# Altium schematic sheet MemoryControl.SchDoc
size A4
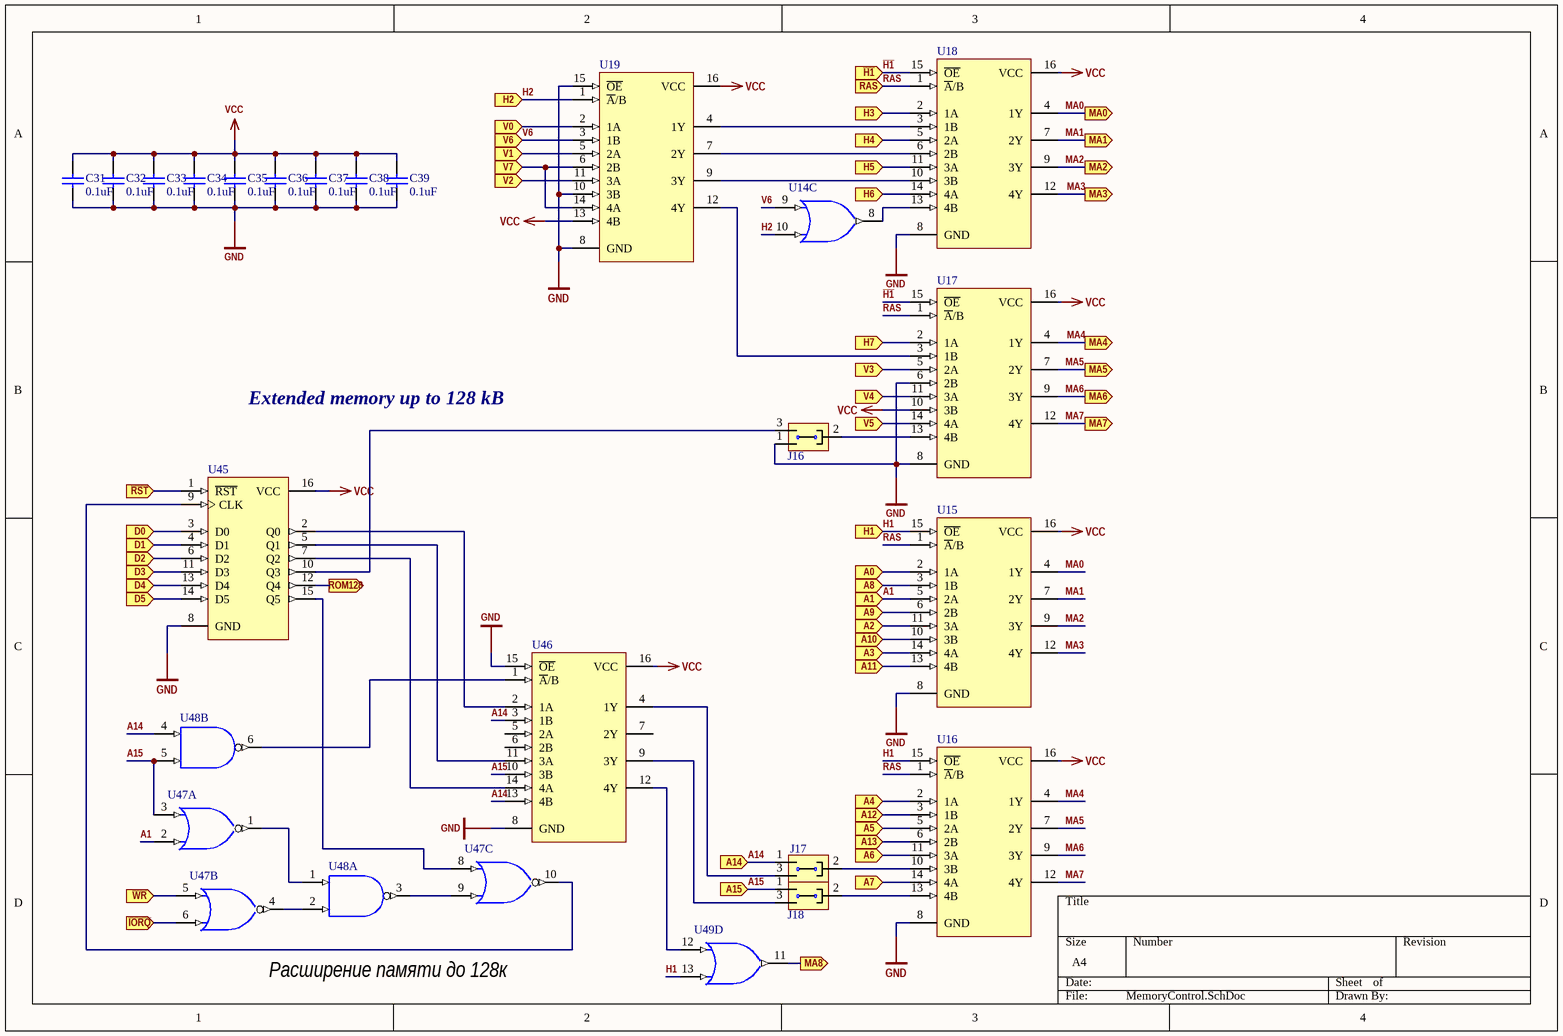
[diagram p0: MemoryControl.SchDoc]

## Parts
C31  value 0.1uF  [RAD-0.3]  (hidden comment: Cap)
C32  value 0.1uF  [RAD-0.3]  (hidden comment: Cap)
C33  value 0.1uF  [RAD-0.3]  (hidden comment: Cap)
C34  value 0.1uF  [RAD-0.3]  (hidden comment: Cap)
C35  value 0.1uF  [RAD-0.3]  (hidden comment: Cap)
C36  value 0.1uF  [RAD-0.3]  (hidden comment: Cap)
C37  value 0.1uF  [RAD-0.3]  (hidden comment: Cap)
C38  value 0.1uF  [RAD-0.3]  (hidden comment: Cap)
C39  value 0.1uF  [RAD-0.3]  (hidden comment: Cap)
J16  Jump3  [MHDR1X3]  (value not drawn)
J17  Jump3  [MHDR1X3]  (value not drawn)
J18  Jump3  [MHDR1X3]  (value not drawn)
U14  (no value)  [N014]  (part C of 4)
U15  (no value)  [N016]
U16  (no value)  [N016]
U17  (no value)  [N016]
U18  (no value)  [N016]
U19  (no value)  [N016]
U45  SN74HC174N  [N016]  (value not drawn)
U46  SN74HC257N  [N016]  (value not drawn)
U47  SN74HC02N  [N014]  (value not drawn)  (parts A,B,C of 4)
U48  SN74HC00N  [N014]  (value not drawn)  (parts A,B of 4)
U49  SN74HC32N  [N014]  (value not drawn)  (part D of 4)

## Ports
A0 (in), A1 (in), A2 (in), A3 (in), A4 (in), A5 (in), A6 (in), A7 (in), A8 (in), A9 (in), A10 (in), A11 (in), A12 (in), A13 (in), A14 (in), A15 (in), D0 (in), D1 (in), D2 (in), D3 (in), D4 (in), D5 (in), H1 (in), H2 (in), H3 (in), H4 (in), H5 (in), H6 (in), H7 (in), MA0 (out), MA1 (out), MA2 (out), MA3 (out), MA4 (out), MA5 (out), MA6 (out), MA7 (out), MA8 (out), RAS (in), ROM128 (out), V0 (in), V1 (in), V2 (in), V3 (in), V4 (in), V5 (in), V6 (in), V7 (in), ~{H1} (in), ~{IORQ} (in), ~{RST} (in), ~{WR} (in)

## Nets
GND: C31.1 C32.1 C33.1 C34.1 C35.1 C36.1 C37.1 C38.1 C39.1 J16.1 U14.7(GND) U15.8(GND) U16.8(GND) U17.6(2B) U17.8(GND) U18.8(GND) U19.8(GND) U19.10(3B) U19.15(~{OE}) U45.8(GND) U46.8(GND) U46.15(~{OE}) U47.7(GND) U48.7(GND) U49.7(GND)
VCC: C31.2 C32.2 C33.2 C34.2 C35.2 C36.2 C37.2 C38.2 C39.2 U14.14(VCC) U15.16(VCC) U16.16(VCC) U17.10(3B) U17.16(VCC) U18.16(VCC) U19.13(4B) U19.16(VCC) U45.16(VCC) U46.16(VCC) U47.14(VCC) U48.14(VCC) U49.14(VCC)
A0: U15.2(1A) ; port A0
A1: U15.5(2A) U47.2(A) ; port A1
A2: U15.11(3A) ; port A2
A3: U15.14(4A) ; port A3
A4: U16.2(1A) ; port A4
A5: U16.5(2A) ; port A5
A6: U16.11(3A) ; port A6
A7: U16.14(4A) ; port A7
A8: U15.3(1B) ; port A8
A9: U15.6(2B) ; port A9
A10: U15.10(3B) ; port A10
A11: U15.13(4B) ; port A11
A12: U16.3(1B) ; port A12
A13: U16.6(2B) ; port A13
A14: J17.1 U46.3(1B) U46.13(4B) U48.4(A) ; port A14
A15: J18.1 U46.10(3B) U47.3(B) U48.5(B) ; port A15
D0: U45.3(D0) ; port D0
D1: U45.4(D1) ; port D1
D2: U45.6(D2) ; port D2
D3: U45.11(D3) ; port D3
D4: U45.13(D4) ; port D4
D5: U45.14(D5) ; port D5
H1: U15.15(~{OE}) U16.15(~{OE}) U49.13(B) ; port H1
H2: U14.10(B) U19.1(~{A}/B) ; port H2
H3: U18.2(1A) ; port H3
H4: U18.5(2A) ; port H4
H5: U18.11(3A) ; port H5
H6: U18.14(4A) ; port H6
H7: U17.2(1A) ; port H7
~{H1}: U17.15(~{OE}) U18.15(~{OE}) ; port ~{H1}
~{IORQ}: U47.6(B) ; port ~{IORQ}
MA0: U15.4(1Y) U18.4(1Y) ; port MA0
MA1: U15.7(2Y) U18.7(2Y) ; port MA1
MA2: U15.9(3Y) U18.9(3Y) ; port MA2
MA3: U15.12(4Y) U18.12(4Y) ; port MA3
MA4: U16.4(1Y) U17.4(1Y) ; port MA4
MA5: U16.7(2Y) U17.7(2Y) ; port MA5
MA6: U16.9(3Y) U17.9(3Y) ; port MA6
MA7: U16.12(4Y) U17.12(4Y) ; port MA7
MA8: U49.11(Y) ; port MA8
~{RST}: U45.1(~{RST}) ; port ~{RST}
RAS: U15.1(~{A}/B) U16.1(~{A}/B) U17.1(~{A}/B) U18.1(~{A}/B) ; port RAS
ROM128: U45.12(Q4) ; port ROM128
V0: U19.2(1A) ; port V0
V1: U19.5(2A) ; port V1
V2: U19.11(3A) ; port V2
V3: U17.5(2A) ; port V3
V4: U17.11(3A) ; port V4
V5: U17.14(4A) ; port V5
V6: U14.9(A) U19.3(1B) ; port V6
V7: U19.6(2B) U19.14(4A) ; port V7
~{WR}: U47.5(A) ; port ~{WR}
NetJ16_2: J16.2 U17.13(4B)
NetJ16_3: J16.3 U45.10(Q3)
NetJ17_2: J17.2 U16.10(3B)
NetJ17_3: J17.3 U46.4(1Y)
NetJ18_2: J18.2 U16.13(4B)
NetJ18_3: J18.3 U46.9(3Y)
NetU14_8: U14.8(Y) U18.13(4B)
NetU17_3: U17.3(1B) U19.12(4Y)
NetU18_3: U18.3(1B) U19.4(1Y)
NetU18_6: U18.6(2B) U19.7(2Y)
NetU18_10: U18.10(3B) U19.9(3Y)
NetU45_2: U45.2(Q0) U46.2(1A)
NetU45_5: U45.5(Q1) U46.11(3A)
NetU45_7: U45.7(Q2) U46.14(4A)
NetU45_9: U45.9(CLK) U47.10(Y)
NetU45_15: U45.15(Q5) U47.8(A)
NetU46_1: U46.1(~{A}/B) U48.6(Y)
NetU46_12: U46.12(4Y) U49.12(A)
NetU47_1: U47.1(Y) U48.1(A)
NetU47_4: U47.4(Y) U48.2(B)
NetU47_9: U47.9(B) U48.3(Y)

Not connected (* = marked no-connect by the designer): U46 5(2A) 6(2B) 7(2Y)

## Notes on the sheet
- Extended memory up to 128 kB
- Расширение памяти до 128к

## Library data of the parts
C31-C39 = Cap: Capacitor; Published: 8-Jun-2000; LatestRevisionDate: 17-Jul-2002; LatestRevisionNote: Re-released for DXP Platform.; PackageReference: RAD-0.3; Publisher: Altium Limited; PackageDescription: Radial Cap, Thru-Hole; 2 Leads; 0.3 in Pin Spacing
U14 U49 = SN74HC32N: Quadruple 2-Input Positive-OR Gate; Published: 8-Jun-2000; LatestRevisionDate: 04-Mar-2005; LatestRevisionNote: Stylized 3D Model Added.; DatasheetVersion: May-1997; PackageVersion: Oct-1995; PackageReference: N014; Publisher: Altium Limited; PackageDescription: DIP; 14 Leads; Row Spacing 7.62 mm; Pitch 2.54 mm; ComponentLink1Description: Manufacturer Link; ComponentLink1URL: http://www.ti.com/; ComponentLink2Description: Datasheet; ComponentLink2URL: http://www-s.ti.com/sc/ds/sn74hc32.pdf
U15-U19 U46 = SN74HC257N: Quadruple 2-Line to 1-Line Data Selector/Multiplexer with 3-State Outputs; Published: 8-Jun-2000; LatestRevisionDate: 04-Mar-2005; LatestRevisionNote: Stylized 3D Model Added.; DatasheetVersion: Jun-1989; PackageVersion: Oct-1995; PackageReference: N016; Publisher: Altium Limited; PackageDescription: DIP; 16 Leads; Row Spacing 7.62 mm; Pitch 2.54 mm; Code_JEDEC: MS-001-BB; ComponentLink1Description: Manufacturer Link; ComponentLink1URL: http://www.ti.com/; ComponentLink2Description: Datasheet; ComponentLink2URL: http://www-s.ti.com/sc/ds/sn74hc257.pdf
U45 = SN74HC174N: Hex D-Type Flip-Flop with Clear; Published: 8-Jun-2000; LatestRevisionDate: 04-Mar-2005; LatestRevisionNote: Stylized 3D Model Added.; DatasheetVersion: May-1997; PackageVersion: Oct-1995; PackageReference: N016; Publisher: Altium Limited; PackageDescription: DIP; 16 Leads; Row Spacing 7.62 mm; Pitch 2.54 mm; Code_JEDEC: MS-001-BB; ComponentLink1Description: Manufacturer Link; ComponentLink1URL: http://www.ti.com/; ComponentLink2Description: Datasheet; ComponentLink2URL: http://www-s.ti.com/sc/ds/sn74hc174.pdf
U47 = SN74HC02N: Quadruple 2-Input Positive-NOR Gate; Published: 8-Jun-2000; LatestRevisionDate: 04-Mar-2005; LatestRevisionNote: Stylized 3D Model Added.; DatasheetVersion: May-1997; PackageVersion: Oct-1995; PackageReference: N014; Publisher: Altium Limited; PackageDescription: DIP; 14 Leads; Row Spacing 7.62 mm; Pitch 2.54 mm; ComponentLink1Description: Manufacturer Link; ComponentLink1URL: http://www.ti.com/; ComponentLink2Description: Datasheet; ComponentLink2URL: http://www-s.ti.com/sc/ds/sn74hc02.pdf
U48 = SN74HC00N: Quadruple 2-Input Positive-NAND Gate; Published: 8-Jun-2000; LatestRevisionDate: 04-Mar-2005; LatestRevisionNote: Stylized 3D Model Added.; DatasheetVersion: May-1997; PackageVersion: Oct-1995; PackageReference: N014; Publisher: Altium Limited; PackageDescription: DIP; 14 Leads; Row Spacing 7.62 mm; Pitch 2.54 mm; ComponentLink1Description: Manufacturer Link; ComponentLink1URL: http://www.ti.com/; ComponentLink2Description: Datasheet; ComponentLink2URL: http://www-s.ti.com/sc/ds/sn74hc00.pdf